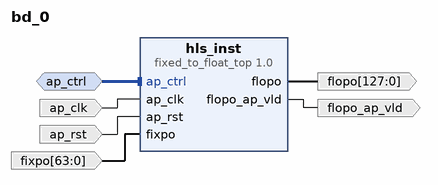
[diagram p0: block diagram of the top level]
# Vivado block design bd_0, xc7z020clg400-1, Vivado 2022.2
create_bd_design bd_0

create_bd_intf_port -mode Slave -vlnv xilinx.com:interface:acc_handshake_rtl:1.0 ap_ctrl
create_bd_port -dir I -type clk ap_clk
set_property -dict {CONFIG.FREQ_HZ 20000000.0} [get_bd_ports ap_clk]
create_bd_port -dir I -type rst ap_rst
set_property -dict {CONFIG.POLARITY ACTIVE_HIGH} [get_bd_ports ap_rst]
create_bd_port -dir I -from 63 -to 0 -type data fixpo
create_bd_port -dir O -from 127 -to 0 -type data flopo
create_bd_port -dir O flopo_ap_vld

create_bd_cell -type ip -vlnv xilinx.com:hls:fixed_to_float_top:1.0 hls_inst

# ---- connections ----

connect_bd_intf_net -intf_net ap_ctrl_0_1 [get_bd_intf_ports ap_ctrl] [get_bd_intf_pins hls_inst/ap_ctrl]
connect_bd_net -net ap_clk_0_1 [get_bd_ports ap_clk] [get_bd_pins hls_inst/ap_clk]
connect_bd_net -net ap_rst_0_1 [get_bd_ports ap_rst] [get_bd_pins hls_inst/ap_rst]
connect_bd_net -net fixpo_0_1 [get_bd_ports fixpo] [get_bd_pins hls_inst/fixpo]
connect_bd_net [get_bd_pins hls_inst/flopo] [get_bd_ports flopo]
connect_bd_net [get_bd_pins hls_inst/flopo_ap_vld] [get_bd_ports flopo_ap_vld]

validate_bd_design
save_bd_design
